# Altium schematic sheet Connectors.SchDoc
size A
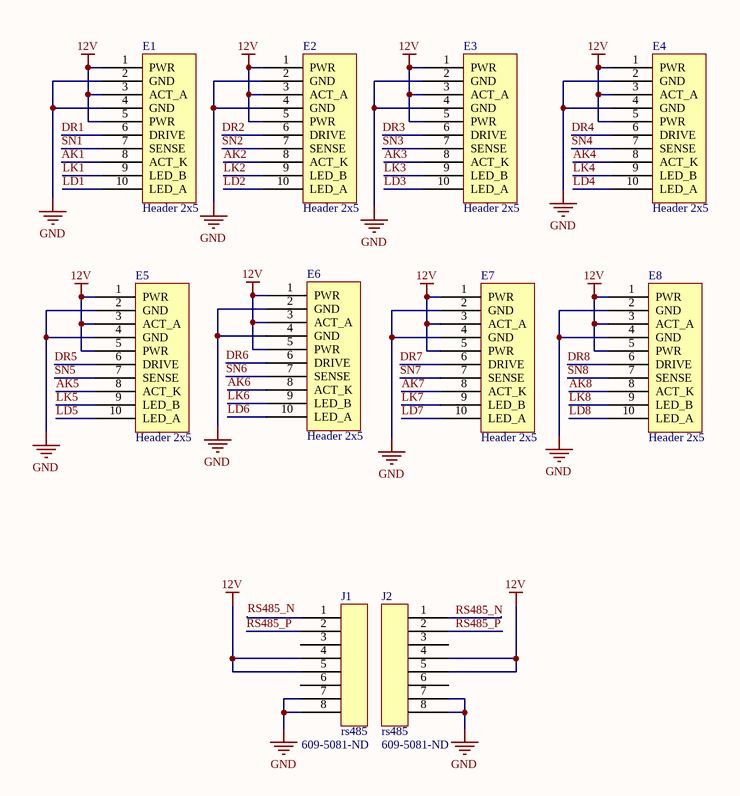
[diagram p0: Connectors.SchDoc]

## Parts
E1  Header 2x5  [2x5]
E2  Header 2x5  [2x5]
E3  Header 2x5  [2x5]
E4  Header 2x5  [2x5]
E5  Header 2x5  [2x5]
E6  Header 2x5  [2x5]
E7  Header 2x5  [2x5]
E8  Header 2x5  [2x5]
J1  rs485  Supplier Part Number 1: 609-5081-ND  [RJ45]
J2  rs485  Supplier Part Number 1: 609-5081-ND  [RJ45]

## Nets
12V: E1.1(PWR) E1.3(ACT_A) E1.5(PWR) E2.1(PWR) E2.3(ACT_A) E2.5(PWR) E3.1(PWR) E3.3(ACT_A) E3.5(PWR) E4.1(PWR) E4.3(ACT_A) E4.5(PWR) E5.1(PWR) E5.3(ACT_A) E5.5(PWR) E6.1(PWR) E6.3(ACT_A) E6.5(PWR) E7.1(PWR) E7.3(ACT_A) E7.5(PWR) E8.1(PWR) E8.3(ACT_A) E8.5(PWR) J1.4 J1.5 J2.4 J2.5
GND: E1.2(GND) E1.4(GND) E2.2(GND) E2.4(GND) E3.2(GND) E3.4(GND) E4.2(GND) E4.4(GND) E5.2(GND) E5.4(GND) E6.2(GND) E6.4(GND) E7.2(GND) E7.4(GND) E8.2(GND) E8.4(GND) J1.7 J1.8 J2.7 J2.8
AK1: E1.8(ACT_K)
AK2: E2.8(ACT_K)
AK3: E3.8(ACT_K)
AK4: E4.8(ACT_K)
AK5: E5.8(ACT_K)
AK6: E6.8(ACT_K)
AK7: E7.8(ACT_K)
AK8: E8.8(ACT_K)
DR1: E1.6(DRIVE)
DR2: E2.6(DRIVE)
DR3: E3.6(DRIVE)
DR4: E4.6(DRIVE)
DR5: E5.6(DRIVE)
DR6: E6.6(DRIVE)
DR7: E7.6(DRIVE)
DR8: E8.6(DRIVE)
LD1: E1.10(LED_A)
LD2: E2.10(LED_A)
LD3: E3.10(LED_A)
LD4: E4.10(LED_A)
LD5: E5.10(LED_A)
LD6: E6.10(LED_A)
LD7: E7.10(LED_A)
LD8: E8.10(LED_A)
LK1: E1.9(LED_B)
LK2: E2.9(LED_B)
LK3: E3.9(LED_B)
LK4: E4.9(LED_B)
LK5: E5.9(LED_B)
LK6: E6.9(LED_B)
LK7: E7.9(LED_B)
LK8: E8.9(LED_B)
RS485_N: J1.1 J2.1
RS485_P: J1.2 J2.2
SN1: E1.7(SENSE)
SN2: E2.7(SENSE)
SN3: E3.7(SENSE)
SN4: E4.7(SENSE)
SN5: E5.7(SENSE)
SN6: E6.7(SENSE)
SN7: E7.7(SENSE)
SN8: E8.7(SENSE)

Not connected (* = marked no-connect by the designer): J1 3 6; J2 3 6

## Library data of the parts
E1-E8 = Header 2x5a: Header
J1 J2 = rj45: Supplier 1: Digi-Key